# EAGLE design Qwiic Solid State Relay (EAGLE 9.6.0)
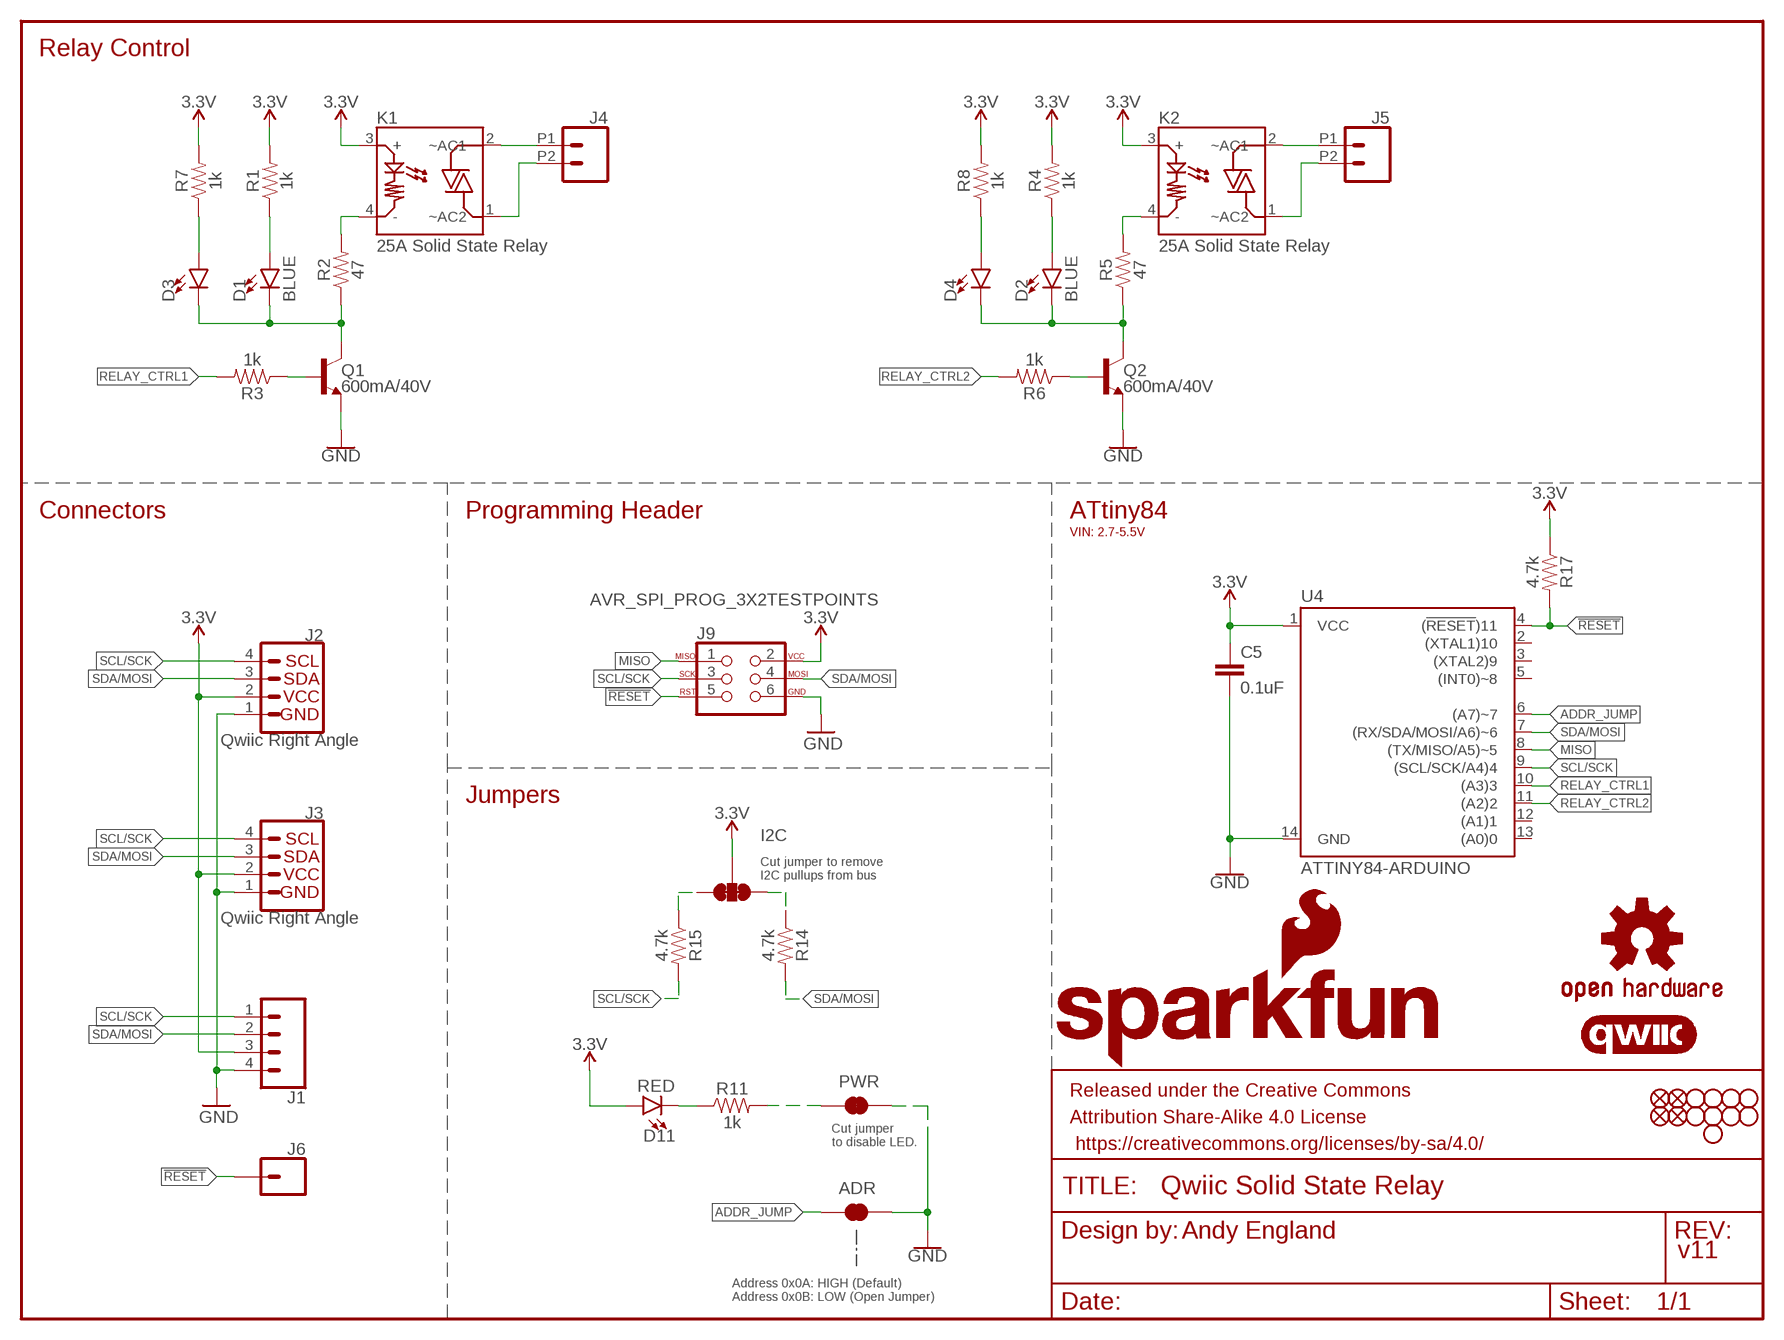
[diagram p0: schematic, sheet 1]

## Parts
ADR  JUMPER-SMT_2_NC_TRACE_SILK  [SMT-JUMPER_2_NC_TRACE_SILK]
C5  0.1uF  0.1UF-0603-25V-(+80/-20%)  [0603]
D1  BLUE  LED-BLUE0603  [LED-0603]
D2  BLUE  LED-BLUE0603  [LED-0603]
D3  LED5MM  [LED_5MM]
D4  LED5MM  [LED_5MM]
D11  RED  LED-RED0603  [LED-0603]
FD1  FIDUCIAL1X2  [FIDUCIAL-1X2]
FD2  FIDUCIAL1X2  [FIDUCIAL-1X2]
FD3  FIDUCIAL1X2  [FIDUCIAL-1X2]
FD4  FIDUCIAL1X2  [FIDUCIAL-1X2]
FRAME1  FRAME-LETTER  [CREATIVE_COMMONS]
I2C  JUMPER-SMT_3_2-NC_TRACE_SILK  [SMT-JUMPER_3_2-NC_TRACE_SILK]
J1  CONN_041X04_NO_SILK  [1X04_NO_SILK]
J2  Qwiic Right Angle  I2C_STANDARDQWIIC  [JST04_1MM_RA]
J3  Qwiic Right Angle  I2C_STANDARDQWIIC  [JST04_1MM_RA]
J4  CONN_02SCREWTERMINAL-6.35MM-2  [1X02_6.35_SCREWTERM]
J5  CONN_02SCREWTERMINAL-6.35MM-2  [1X02_6.35_SCREWTERM]
J6  CONN_01PTH_NO_SILK_YES_STOP  [1X01_NO_SILK]
J9  AVR_SPI_PROG_3X2TESTPOINTS  [2X3_TEST_POINTS]
JP1  STAND-OFF  [STAND-OFF]
JP2  STAND-OFF  [STAND-OFF]
JP3  STAND-OFF  [STAND-OFF]
JP4  STAND-OFF  [STAND-OFF]
JP5  STAND-OFF  [STAND-OFF]
JP6  STAND-OFF  [STAND-OFF]
JP7  STAND-OFF  [STAND-OFF]
JP8  STAND-OFF  [STAND-OFF]
JP10  STAND-OFF  [STAND-OFF]
K1  25A Solid State Relay  SIP_SOLIDSTATERELAY  [PTH_SOLIDSTATERELAY]
K2  25A Solid State Relay  SIP_SOLIDSTATERELAY  [PTH_SOLIDSTATERELAY]
LOGO1  SFE_LOGO_NAME_FLAME.2_INCH  [SFE_LOGO_NAME_FLAME_.2]
LOGO2  OSHW-LOGOS  [OSHW-LOGO-S]
LOGO3  SFE_LOGO_NAME_FLAME.3_INCH  [SFE_LOGO_NAME_FLAME_.3]
LOGO4  QWIIC_LOGO_5MM  [QWIIC_5MM]
PWR  JUMPER-SMT_2_NC_TRACE_SILK  [SMT-JUMPER_2_NC_TRACE_SILK]
Q1  600mA/40V  TRANS_NPN-MMBT2222AL  [SOT23-3]
Q2  600mA/40V  TRANS_NPN-MMBT2222AL  [SOT23-3]
R1  1k  1KOHM-0603-1/10W-1%  [0603]
R2  47  47OHM-0603-1/10W-1%  [0603]
R3  1k  1KOHM-0603-1/10W-1%  [0603]
R4  1k  1KOHM-0603-1/10W-1%  [0603]
R5  47  47OHM-0603-1/10W-1%  [0603]
R6  1k  1KOHM-0603-1/10W-1%  [0603]
R7  1k  1KOHM-0603-1/10W-1%  [0603]
R8  1k  1KOHM-0603-1/10W-1%  [0603]
R11  1k  1KOHM-0603-1/10W-1%  [0603]
R14  4.7k  4.7KOHM-0603-1/10W-1%  [0603]
R15  4.7k  4.7KOHM-0603-1/10W-1%  [0603]
R17  4.7k  4.7KOHM-0603-1/10W-1%  [0603]
U4  ATTINY84-ARDUINO  [SO14]

## Nets
3.3V: C5.1 D11.A I2C.2 J1.3 J2.2 J3.2 J9.2 K1.3(+) K2.3(+) R1.2 R4.2 R7.2 R8.2 R17.1 U4.1(VCC)
!RESET: J6.1 J9.5 R17.2 U4.4((!RESET!)11)
ADDR_JUMP: ADR.1 U4.6((A7)~7)
GND: ADR.2 C5.2 J1.4 J2.1 J3.1 J9.6 PWR.1 Q1.2(E) Q2.2(E) U4.14(GND)
MISO: J9.1 U4.8((TX/MISO/A5)~5)
N$3: K2.4(-) R5.2
N$4: D2.A R4.1
N$5: J4.P1 K1.2(~AC1)
N$6: J4.P2 K1.1(~AC2)
N$7: D1.A R1.1
N$8: J5.P1 K2.2(~AC1)
N$9: J5.P2 K2.1(~AC2)
N$10: K1.4(-) R2.2
N$11: D1.C D3.K(C) Q1.3(C) R2.1
N$12: D3.A R7.1
N$13: D11.C R11.1
N$14: PWR.2 R11.2
N$15: I2C.3 R15.1
N$16: I2C.1 R14.1
N$17: D2.C D4.K(C) Q2.3(C) R5.1
N$18: D4.A R8.1
OPTO_1: Q1.1(B) R3.1
OPTO_2: Q2.1(B) R6.1
RELAY_CTRL1: R3.2 U4.10((A3)3)
RELAY_CTRL2: R6.2 U4.11((A2)2)
SCL/SCK: J1.1 J2.4 J3.4 J9.3 R15.2 U4.9((SCL/SCK/A4)4)
SDA/MOSI: J1.2 J2.3 J3.3 J9.4 R14.2 U4.7((RX/SDA/MOSI/A6)~6)
Unconnected: U4.2((XTAL1)10) U4.3((XTAL2)9) U4.5((INT0)~8) U4.12((A1)1) U4.13((A0)0)

## Notes on the sheet
- Relay Control
- Connectors | Programming Header | ATtiny84
- VIN: 2.7-5.5V
- Jumpers
- Cut jumper to remove 
  I2C pullups from bus
- Cut jumper 
  to disable LED.
- Andy England
- v11
- Address 0x0A: HIGH (Default)
  Address 0x0B: LOW (Open Jumper)

## Library data of the parts
ADR PWR = SparkFun-Jumpers:JUMPER-SMT_2_NC_TRACE: Normally closed trace jumper This jumper has a trace between two pads so it's normally closed (NC). Use a razor knife to open the connection. For best results follow the IPC guidelines for cutting traces: Cutout at least 0.063 mm (0.005 in). Remove all loose material to clean up the cut area. Seal the cut with an approved epoxy. Reapply solder to reclose the connection.
C5 = SparkFun-Capacitors:0.1UF: 0.1µF ceramic capacitors A capacitor is a passive two-terminal electrical component used to store electrical energy temporarily in an electric field.; PROD_ID: CAP-00810
D1 D2 = SparkFun-LED:LED-BLUE: Blue SMD LED Used in manufacturing of various products at SparkFun Packages: 0603 - SMD 0603 package [Product Link] <http://www.digikey.com/product-detail/en/SMLE12BC7TT86/511-1589-2-ND/1641808> 1206 - SMD1206 package [Product Link] <http://www.digikey.com/product-detail/en/lite-on-inc/LTST-C150TBKT/160-1643-1-ND/573584> SparkFun Products: ESP8266 Thing-Dev Board <https://www.sparkfun.com/products/13711> RedBoard <https://www.sparkfun.com/products/12757>; PROD_ID: DIO-08575
D3 D4 = SparkFun-LED:LED: LED (Generic) Standard schematic elements and footprints for 5mm, 3mm, 1206, and 0603 sized LEDs. Generic LEDs with no color specified.
D11 = SparkFun-LED:LED-RED: Red SMD LED Used in manufacturing of most products at SparkFun Packages: 0603 - SMD 0603 package [Product Link] <http://docs.avagotech.com/docs/AV02-0551EN> 0603 SMART - SMD 0603 SMART package ( more efficient and expensive)[Product Link] <http://www.osram-os.com/Graphics/XPic2/00077099_0.pdf> 1206 - SMD1206 package [Product Link] <https://www.sparkfun.com/datasheets/DevTools/LilyPad/Q150OVS4.pdff> SparkFun Products: Pro Mini 328 -5V <https://www.sparkfun.com/products/821> RedBoard <https://www.sparkfun.com/products/12757> IOIO-OTG <https://www.sparkfun.com/products/13613>; PROD_ID: DIO-00819
FD1-FD4 = SparkFun-Aesthetics:FIDUCIAL: Fiducial Alignment Points Point-of-reference for pick-and-place machines and other optical instruments.
FRAME1 = SparkFun-Aesthetics:FRAME-LETTER: Schematic Frame - Letter Standard 8.5x11 US Letter frame
I2C = SparkFun-Jumpers:JUMPER-SMT_3_2-NC_TRACE: Normally closed trace jumper (2 of 2 connections) This jumper has a trace between all three pads so they are normally closed (NC). Use a razor knife to open the connection(s). For best results follow the IPC guidelines for cutting traces: Cutout at least 0.063 mm (0.005 in). Remove all loose material to clean up the cut area. Seal the cut with an approved epoxy. Reapply solder to reclose the connection(s).
J1 = SparkFun-Connectors:CONN_04: Multi connection point. Often used as Generic Header-pin footprint for 0.1 inch spaced/style header connections On any of the 0.1 inch spaced packages, you can populate with these: Break Away Headers - Straight <https://www.sparkfun.com/products/116> (PRT-00116) Break Away Male Headers - Right Angle <https://www.sparkfun.com/products/553> (PRT-00553) Female Headers <https://www.sparkfun.com/products/115> (PRT-00115) Break Away Headers - Machine Pin <https://www.sparkfun.com/products/117> (PRT-00117) Break Away Female Headers - Swiss Machine Pin <https://www.sparkfun.com/products/743> (PRT-00743) For SCREWTERMINALS and SPRING TERMINALS visit here: Screw Terimnals on SparkFun.com <https://www.sparkfun.com/search/results?term=Screw+Terminals> (5mm/3.5mm/2.54mm spacing) This device is also useful as a general connection point to wire up your design to another part of your project. Our various solder wires solder well into these plated through hole pads. Hook-Up Wire - Assortment (Stranded, 22 AWG) <https://www.sparkfun.com/products/11375> (PRT-11375) Hook-Up Wire - Assortment (Solid Core, 22 AWG) <https://www.sparkfun.com/products/11367> (PRT-11367) View the entire wire category on our website here <https://www.sparkfun.com/categories/141> Special notes: Molex polarized connector foot print use with SKU : PRT-08231 with associated crimp pins and housings. 1MM SMD Version SKU: PRT-10208; PROD_ID: CONN-09696
J2 J3 = SparkFun-Connectors:I2C_STANDARD: SparkFun I2C Standard Pinout Header SparkFun has standardized on a pinout for all I2C based sensor breakouts. This pinout allows I2C boards to be plugged directly into the headers on Arduino Uno compatible boards, and to be daisy chained easily. Example SparkFun Products: SparkFun Atmospheric Sensor Breakout - BME280 <https://www.sparkfun.com/products/13676> SparkFun Altitude/Pressure Sensor Breakout - MPL3115A2 <https://www.sparkfun.com/products/11084> SparkFun TOF Range Finder Sensor - VL6180 <https://www.sparkfun.com/products/12785>; PROD_ID: CONN-13694
J4 J5 = SparkFun-Connectors:CONN_02: Multi connection point. Often used as Generic Header-pin footprint for 0.1 inch spaced/style header connections On any of the 0.1 inch spaced packages, you can populate with these: Break Away Headers - Straight <https://www.sparkfun.com/products/116> (PRT-00116) Break Away Male Headers - Right Angle <https://www.sparkfun.com/products/553> (PRT-00553) Female Headers <https://www.sparkfun.com/products/115> (PRT-00115) Break Away Headers - Machine Pin <https://www.sparkfun.com/products/117> (PRT-00117) Break Away Female Headers - Swiss Machine Pin <https://www.sparkfun.com/products/743> (PRT-00743) For SCREWTERMINALS and SPRING TERMINALS visit here: Screw Terimnals on SparkFun.com <https://www.sparkfun.com/search/results?term=Screw+Terminals> (5mm/3.5mm/2.54mm spacing) This device is also useful as a general connection point to wire up your design to another part of your project. Our various solder wires solder well into these plated through hole pads. Hook-Up Wire - Assortment (Stranded, 22 AWG) <https://www.sparkfun.com/products/11375> (PRT-11375) Hook-Up Wire - Assortment (Solid Core, 22 AWG) <https://www.sparkfun.com/products/11367> (PRT-11367) View the entire wire category on our website here <https://www.sparkfun.com/categories/141> Special notes: Molex polarized connector foot print use with: PRT-08233 with associated crimp pins and housings. 2.54_SCREWTERM for use with PRT-10571. 3.5mm Screw Terminal footprints for PRT-08084 5mm Screw Terminal footprints for use with PRT-08432; PROD_ID: CONN-15154
J6 = SparkFun-Connectors:CONN_01: Single connection point. Often used as Generic Header-pin footprint for 0.1 inch spaced/style header connections On any of the 0.1 inch spaced packages, you can populate with these: Break Away Headers - Straight <https://www.sparkfun.com/products/116> (PRT-00116) Break Away Male Headers - Right Angle <https://www.sparkfun.com/products/553> (PRT-00553) Female Headers <https://www.sparkfun.com/products/115> (PRT-00115) Break Away Headers - Machine Pin <https://www.sparkfun.com/products/117> (PRT-00117) Break Away Female Headers - Swiss Machine Pin <https://www.sparkfun.com/products/743> (PRT-00743) This device is also useful as a general connection point to wire up your design to another part of your project. Our various solder wires solder well into these plated through hole pads. Hook-Up Wire - Assortment (Stranded, 22 AWG) <https://www.sparkfun.com/products/11375> (PRT-11375) Hook-Up Wire - Assortment (Solid Core, 22 AWG) <https://www.sparkfun.com/products/11367> (PRT-11367) View the entire wire category on our website here <https://www.sparkfun.com/categories/141> Special notes: SMTSO-256-ET is a "flush mount" nut for a 4-40 screw. We mostly use this on specialty testbeds; it is a nice way to connect hardware to your PCB at an adjustable hieght. Also note, the SNAP packages are for using a snappable style connector. We sell a baggie of snaps and they are also used on two LilyPad designs: Snap Assortment - 30 pack (male and female) <https://www.sparkfun.com/products/11347> (DEV-11347) LilyPad Arduino SimpleSnap <https://www.sparkfun.com/products/10941> (DEV-10941) LilyPad SimpleSnap Protoboard <https://www.sparkfun.com/products/10940> (DEV-10940)
J9 = SparkFun-Connectors:AVR_SPI_PROG_3X2: AVR ISP 6 Pin This is the reduced ISP connector for AVR programming. Common on Arduino. This footprint will take up less PCB space and can be used with a 10-pin to 6-pin adapter such as SKU: BOB-08508 **Special note about "TEST_POINT" package. The stop mask is on the top side, so if you want your programming test points to be on the bottom of your board, make sure to place this package on the bottom side of the board. This also ensure that the orientation to program from the bottom side will be correct. SparkFun Products: SparkFun ISP Pogo Adapter <https://www.sparkfun.com/products/11591> - NS Tiny AVR Programmer <https://www.sparkfun.com/products/11801> -PTH
JP1-JP8 JP10 = SparkFun-Hardware:STAND-OFF: Stand Off Drill holes for mechanically mounting via screws, standoffs, etc. Note: Use the keepout ring to avoid running the screw head into surrounding components. Variant Overviews STAND-OFF - Mechanical footprint for a #4 phillips button head screw. STAND-OFF-TIGHT - Mechanical footprint for a #4 phillips button head screw, Example SparkFun Products Screw - Phillips Head (1/4", 4-40, 10 pack) <https://www.sparkfun.com/products/10453> (PRT-10453) Screw - Phillips Head (1/2", 4-40, 10 pack) <https://www.sparkfun.com/products/10452> (PRT-10452) Screw - Phillips Head (3/4", 4-40, 10 pack) <https://www.sparkfun.com/products/10451> (PRT-10451) Screw - Phillips Head (1", 4-40, 10 pack) <https://www.sparkfun.com/products/10450> (PRT-10450)
K1 K2 = SparkFun-DiscreteSemi:SIP_SOLIDSTATERELAY: Tyco Electronics SSRF-240D25 - 25A Solid State Relay This through hole Solid State Relay is capable of handling up to 25A and uses Zero-Crossing to minimize interference when switching an AC load; PROD_ID: COM-15155
LOGO1 LOGO3 = SparkFun-Aesthetics:SFE_LOGO_NAME_FLAME: SparkFun Font Logo w/ Flame This is the SparkFun full logo. The logo on the schematic will always be the same size; the package variant is the height of the flame part of the logo. Default layer for the logo on the board is tSilk.
LOGO2 = SparkFun-Aesthetics:OSHW-LOGO: Open-Source Hardware (OSHW) Logo This logo indicates the piece of hardware it is found on incorporates a OSHW license and/or adheres to the definition of open source hardware found here: http://freedomdefined.org/OSHW
LOGO4 = SparkFun-Aesthetics:QWIIC_LOGO: Qwiic Logos for placement on schematic and PCB. The 5.5mm silk logo is best for placing next to Qwiic connector.
Q1 Q2 = SparkFun-DiscreteSemi:TRANS_NPN: NPN transistor Current controlled devices typically used to amplify current or used as a switch. BC547 - COM-08928 <http://www.sparkfun.com/products/8928> (TO-92 45V 100mA) (1.Collector 2.Base 3.Emitter) 2N3904 - COM-00521 <http://www.sparkfun.com/products/521> (TO-92 40V 200mA) (1.Emitter 2.Base 3.Collector) P2N2222A - COM-12852 <http://www.sparkfun.com/products/12852> (TO-92 40V 600mA) (1.Collector 2.Base 3.Emitter); PROD_ID: TRANS-08049
R1 R3 R4 R6-R8 R11 = SparkFun-Resistors:1KOHM: 1kΩ resistor A resistor is a passive two-terminal electrical component that implements electrical resistance as a circuit element. Resistors act to reduce current flow, and, at the same time, act to lower voltage levels within circuits. - Wikipedia; PROD_ID: RES-07856
R2 R5 = SparkFun-Resistors:47OHM: 47Ω resistor A resistor is a passive two-terminal electrical component that implements electrical resistance as a circuit element. Resistors act to reduce current flow, and, at the same time, act to lower voltage levels within circuits. - Wikipedia; PROD_ID: RES-14282
R14 R15 R17 = SparkFun-Resistors:4.7KOHM: 4.7kΩ resistor A resistor is a passive two-terminal electrical component that implements electrical resistance as a circuit element. Resistors act to reduce current flow, and, at the same time, act to lower voltage levels within circuits. - Wikipedia; PROD_ID: RES-07857
U4 = SparkFun-IC-Microcontroller:ATTINY84-ARDUINO; PROD_ID: IC-14155

## Board
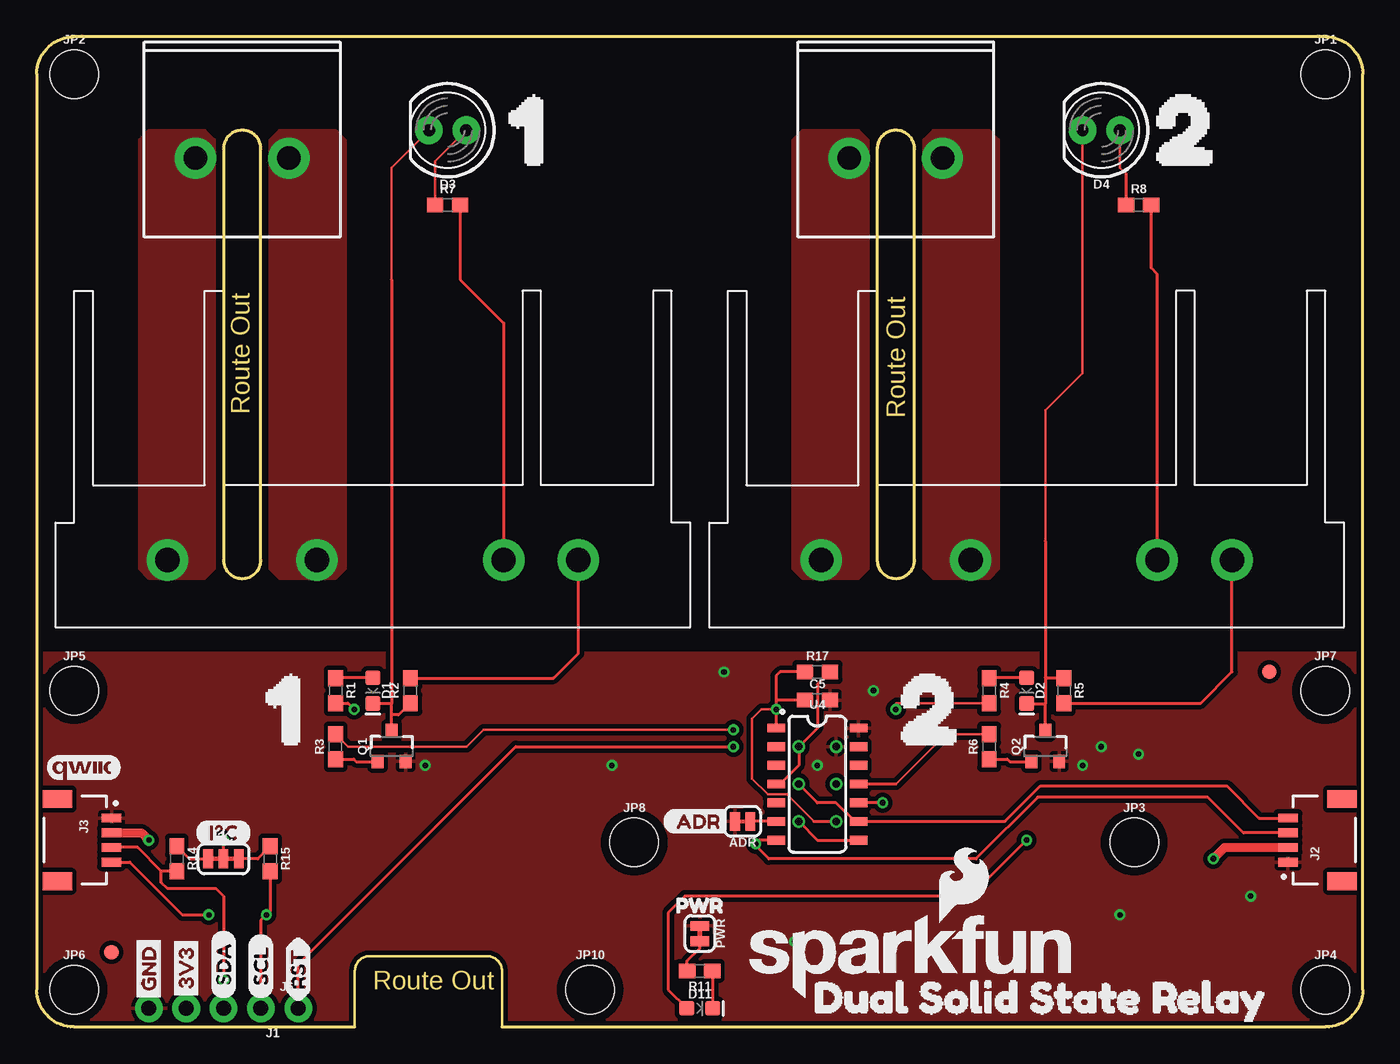
[diagram p1: board, top side]
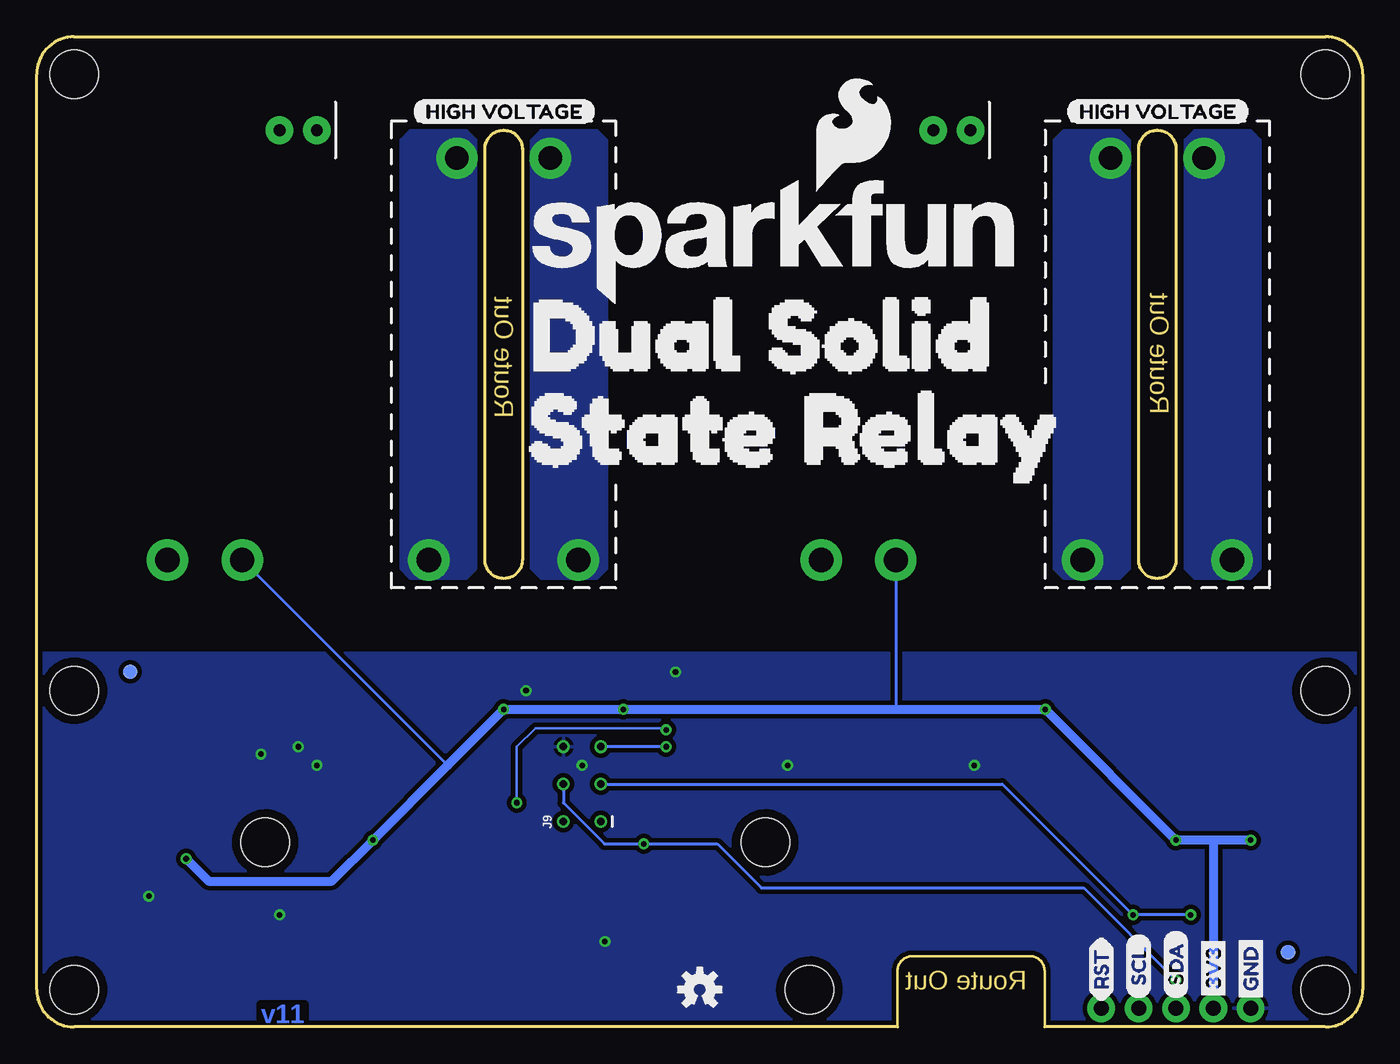
[diagram p2: board, bottom side, seen from below]

Size 90.17 x 67.31 mm. Coordinates in mm from the lower left corner, seen from the top.
Outline: 2.54,0 21.63,0 21.63,3.81 arc-90 22.63,4.81 30.63,4.81 arc-90 31.63,3.81 31.63,0 87.63,0 arc90 90.17,2.54 90.17,64.77 arc90 87.63,67.31 2.54,67.31 arc90 0,64.77 0,2.54 arc90 2.54,0
Outline: 13.97,60.96 arc90 12.7,59.69 12.7,31.75 arc90 13.97,30.48 arc90 15.24,31.75 15.24,59.69 arc90 13.97,60.96
Outline: 58.42,30.48 arc90 59.69,31.75 59.69,59.69 arc90 58.42,60.96 arc90 57.15,59.69 57.15,31.75 arc90 58.42,30.48
Copper layers (1*16): Top 0.035mm / dielectric 1.5mm / Bottom 0.035mm
Design rules "SparkFun-2-layer-TIGHT": minimum track width 7mil, minimum drill 15mil, track to track 7mil, track to pad 7mil, pad to pad 7mil, via to via 7mil, smd to smd 7mil, copper to edge 7mil, drill to drill 7mil, minimum pad ring 7mil, minimum via ring 7mil, stop-mask expansion 4mil, vias tented up to drill 25mil, thermal gap 10mil

### Footprints (pad centres in the part's own frame; a part is rotated, then mirrored left to right if it is on the bottom)
SMT-JUMPER_2_NC_TRACE_SILK = smd 0.66 x 1.27: 1 -0.521,0; 2 0.521,0
0603 = smd 1.1 x 1: 1 -0.85,0; 2 0.85,0
LED-0603 = smd 1 x 1: A -0.877,0; C 0.877,0
LED_5MM = drill 0.813 pad 1.88: A -1.27,0; K 1.27,0
FIDUCIAL-1X2 = smd 1 x 1: 1 0,0
SMT-JUMPER_3_2-NC_TRACE_SILK = smd 0.66 x 1.27: 1 -1.041,0; 2 0,0; 3 1.041,0
1X04_NO_SILK = drill 1.016 pad 1.88: 1 0,0; 2 2.54,0; 3 5.08,0; 4 7.62,0
JST04_1MM_RA = smd 0.6 x 1.35: 1 -1.5,0; 2 -0.5,0; 3 0.5,0; 4 1.5,0 | smd 1.2 x 2: NC1 2.8,-3.675; NC2 -2.8,-3.675
1X02_6.35_SCREWTERM = drill 1.6 pad 2.8: P1 -3.175,0; P2 3.175,0
1X01_NO_SILK = drill 1.016 pad 1.88: 1 0,0
2X3_TEST_POINTS = drill 0.508: 1 -2.54,-1.27; 2 -2.54,1.27; 3 0,-1.27; 4 0,1.27; 5 2.54,-1.27; 6 2.54,1.27
STAND-OFF = hole 3.302: 0,0
PTH_SOLIDSTATERELAY = drill 1.651 pad 2.819: 1 0,0; 2 10.16,0; 3 22.86,0; 4 27.94,0
SOT23-3 = smd 0.8 x 0.9: 1 -0.95,-1; 2 0.95,-1; 3 0,1.1
SO14 = smd 0.6 x 1.2: 1 -3.81,-2.8; 2 -2.54,-2.8; 3 -1.27,-2.8; 4 0,-2.8; 5 1.27,-2.8; 6 2.54,-2.8; 7 3.81,-2.8; 8 3.81,2.8; 9 2.54,2.8; 10 1.27,2.8; 11 0,2.8; 12 -1.27,2.8; 13 -2.54,2.8; 14 -3.81,2.8

### Placement (x,y rotation side)
ADR  48.01,13.97 180 top
C5  53.09,22.23 0 top
D1  22.86,22.86 270 top
D2  67.31,22.86 270 top
D3  27.94,60.96 180 top
D4  72.39,60.96 180 top
D11  45.09,1.27 0 top
FD1  83.82,24.13 0 top
FD2  83.82,24.13 0 bottom
FD3  5.08,5.08 0 bottom
FD4  5.08,5.08 0 top
FRAME1  22.86,-8.89 0 top  (outside the outline)
I2C  12.7,11.43 0 top
J1  15.24,1.27 180 top
J2  85.09,12.7 90 top
J3  5.08,12.7 270 top
J4  13.97,59.05 180 top
J5  58.42,59.05 180 top
J6  17.78,1.27 0 top
J9  53.09,16.51 90 bottom
JP1  87.63,64.77 0 top
JP2  2.54,64.77 0 top
JP3  74.63,12.54 0 top
JP4  87.63,2.54 0 top
JP5  2.54,22.86 0 top
JP6  2.54,2.54 0 top
JP7  87.63,22.86 0 top
JP8  40.63,12.54 0 top
JP10  37.63,2.54 0 top
K1  8.89,31.75 0 top
K2  53.34,31.75 0 top
LOGO1  59.48,4.81 0 top
LOGO2  45.09,2.54 0 bottom
LOGO3  40.13,53.34 0 bottom
LOGO4  3.17,17.65 0 top
PWR  45.09,6.35 270 top
Q1  24.13,19.05 0 top
Q2  68.58,19.05 0 top
R1  20.32,22.86 270 top
R2  25.4,22.86 90 top
R3  20.32,19.05 90 top
R4  64.77,22.86 270 top
R5  69.85,22.86 270 top
R6  64.77,19.05 90 top
R7  27.94,55.88 0 top
R8  74.93,55.88 0 top
R11  45.09,3.81 180 top
R14  9.53,11.43 270 top
R15  15.88,11.43 270 top
R17  53.09,24.13 0 top
U4  53.09,16.51 270 top
U$1  [DUAL_SOLID_STATE_RELAY0]  51,2 0 top
U$2  [DUAL_SOLID0]  60.71,46.99 0 bottom
U$3  [STATE_RELAY1]  60.83,40.64 0 bottom
U$5  [11]  11.43,21.59 0 top
U$6  [22]  54.61,21.59 0 top
U$7  [HIGH_VOLTAGE0]  20.19,62.23 0 bottom
U$8  [HIGH_VOLTAGE0]  64.64,62.23 0 bottom
U$9  [11]  27.94,60.96 0 top
U$10  [22]  72.01,60.96 0 top
U$11  [RST_I]  17.78,1.65 90 top
U$12  [RST_I]  17.78,1.65 90 bottom
U$13  [GND_P]  7.62,1.52 90 top
U$14  [GND_P]  7.62,1.52 90 bottom
U$15  [I2C]  10.79,13.21 0 top
U$16  [3V3_P]  10.16,1.65 90 top
U$17  [3V3_P]  10.16,1.65 90 bottom
U$18  [SCL_IO]  15.24,1.91 90 top
U$19  [SCL_IO]  15.24,1.91 90 bottom
U$20  [SDA_IO]  12.7,1.91 90 top
U$21  [SDA_IO]  12.7,1.91 90 bottom
U$23  [ADR3]  42.54,13.97 0 top
U$24  [PWR_TO]  42.55,8.26 0 top

### Tracks (layer width: path | path; a pad name or v marks a point on that pad's centre or on a via)
3.3V  (via drill 0.38)
  Top 0.178: R4.2 58.46,22.01 58.42,21.97 v58.42,21.59 | v50.28,21.59 49.27,21.59 48.64,20.95 48.64,16.88 49.71,15.81 51.01,15.81 52.85,13.97
  Top 0.203: R17.1 50.55,24.13 50.28,23.87 50.28,22.23 | 50.28,22.23 v50.28,21.59 U4.1 | C5.1 50.28,22.23 | 52.85,13.97 J9.2 | v67.31,12.7 63.5,8.89 44.08,8.89 42.94,7.75 42.94,2.54 D11.A | I2C.2 v12.7,12.7 | R7.2 28.79,50.8 31.75,47.84 K1.3 | R1.2 21.17,22.01 v21.59,21.59 | R8.2 75.78,51.6 76.2,51.18 K2.3
  Top 0.61: J3.2 7.12,13.2 v7.62,12.7 | v80.01,11.43 80.78,12.2 J2.2
  Bottom 0.203: K1.3 31.75,21.59 | K2.3 62.23,17.78
  Bottom 0.61: v7.62,12.7 10.16,12.7 | 10.16,12.7 v12.7,12.7 v21.59,21.59 31.75,21.59 v50.28,21.59 v58.42,21.59 62.23,17.78 v67.31,12.7 70.1,9.91 78.49,9.91 v80.01,11.43 | 10.16,12.7 J1.3
!RESET  (via drill 0.38)
  Top 0.203: R17.2 53.09,23.28 53.09,20.32 J9.5 51.81,17.78 50.55,16.51 U4.4 | J6.1 17.78,4.27 32.56,19.05 v47.37,19.05
  Bottom 0.203: v47.37,19.05 J9.5
ADDR_JUMP
  Top 0.203: U4.6 ADR.1
GND  (via drill 0.38)
  other vias: 46.73,24.13 56.9,22.86 53.09,17.78 74.93,18.54 71.12,17.78 51.53,5.81 73.66,7.62 72.39,19.05 82.55,8.89 26.41,17.78 39.12,17.78
  pour Top (isolate 0.305): 0,0 90.17,0 90.17,25.4 0,25.4
  pour Bottom (isolate 0.305): 90.17,0 0,0 0,25.4 90.17,25.4
MISO
  Top 0.203: J9.1 53.09,12.7 U4.8
N$3
  Top 0.203: R5.2 79.16,22.01 81.28,24.13 K2.4
N$4
  Top 0.203: D2.A 64.8,23.74 R4.1
N$5
  pour Bottom (no thermals): 20.32,60.96 16.51,60.96 15.88,60.33 15.88,31.11 16.51,30.48 20.32,30.48 20.95,31.11 20.95,60.33
  pour Top (no thermals): 16.51,60.96 20.32,60.96 20.95,60.33 20.95,31.11 20.32,30.48 16.51,30.48 15.88,31.11 15.88,60.33
N$6
  pour Bottom (no thermals): 11.43,60.96 7.62,60.96 6.99,60.33 6.99,31.11 7.62,30.48 11.43,30.48 12.06,31.11 12.06,60.33
  pour Top (no thermals): 7.62,60.96 11.43,60.96 12.06,60.33 12.06,31.11 11.43,30.48 7.62,30.48 6.99,31.11 6.99,60.33
N$7
  Top 0.203: D1.A 20.35,23.74 R1.1
N$8
  pour Top (no thermals): 60.96,60.96 64.77,60.96 65.41,60.33 65.41,31.11 64.77,30.48 60.96,30.48 60.33,31.11 60.33,60.33
  pour Bottom (no thermals): 64.77,60.96 60.96,60.96 60.33,60.33 60.33,31.11 60.96,30.48 64.77,30.48 65.41,31.11 65.41,60.33
N$9
  pour Bottom (no thermals): 55.88,60.96 52.07,60.96 51.44,60.33 51.44,31.11 52.07,30.48 55.88,30.48 56.52,31.11 56.52,60.33
  pour Top (no thermals): 52.07,60.96 55.88,60.96 56.52,60.33 56.52,31.11 55.88,30.48 52.07,30.48 51.44,31.11 51.44,60.33
N$10
  Top 0.203: R2.2 35.14,23.71 36.83,25.4 K1.4
N$11
  Top 0.178: D3.K 24.13,58.42 24.13,50.8
  Top 0.203: 25.37,21.98 R2.1 24.6,21.21 24.13,21.21 | 24.13,21.98 D1.C | Q1.3 24.13,21.21 | 24.13,21.21 24.13,21.98 | 24.13,50.8 24.13,21.98
N$12
  Top 0.178: R7.1 27.09,58.84 D3.A
N$13
  Top 0.203: R11.1 45.96,3.78 D11.C
N$14
  Top 0.203: R11.2 44.23,4.48 45.09,5.33 PWR.2
N$15
  Top 0.203: R15.1 15.03,11.43 I2C.3
N$16
  Top 0.203: R14.1 10.38,11.43 I2C.1
N$17
  Top 0.178: D4.K 71.12,44.45 68.58,41.91 68.58,33.02
  Top 0.203: D2.C 68.58,21.98 | Q2.3 68.58,21.98 | 68.58,33.02 68.58,23.75 | 68.58,23.75 68.58,21.98 | R5.1 68.62,23.71 68.58,23.75
N$18
  Top 0.178: 74.08,58 73.66,58.42 D4.A
  Top 0.203: R8.1 74.08,58
OPTO_1
  Top 0.203: R3.1 21.55,18.2 21.72,18.03 23.16,18.03 Q1.1
OPTO_2
  Top 0.203: R6.1 66,18.2 66.17,18.03 67.61,18.03 Q2.1
RELAY_CTRL1  (via drill 0.38)
  Top 0.178: v47.37,20.19 30.37,20.19 29.23,19.05 21.17,19.05 R3.2
  Top 0.203: v57.53,15.24 U4.10
  Bottom 0.178: v47.37,20.19 47.5,20.32 56.26,20.32 57.53,19.05 v57.53,15.24
RELAY_CTRL2
  Top 0.178: R6.2 61.81,19.9 58.42,16.51
  Top 0.203: 58.42,16.51 U4.11
SCL/SCK  (via drill 0.38)
  Top 0.203: J9.3 53.09,15.24 54.35,15.24 55.62,13.97 U4.9 65.85,13.97 68.26,16.38 80.93,16.38 83.11,14.2 J2.4 | J1.1 15.24,7.24 v15.62,7.62 15.88,7.87 R15.2 | J3.4 6.33,11.2 9.91,7.62 v11.7,7.62
  Bottom 0.203: J9.3 24.51,16.51 v15.62,7.62 v11.7,7.62
SDA/MOSI  (via drill 0.38)
  Top 0.203: U4.7 49.14,12.7 v48.89,12.45 48.89,12.32 49.78,11.43 63.88,11.43 68.07,15.62 79.63,15.62 82.05,13.2 J2.3 | v12.7,3.17 12.7,8.89 12.19,9.4 8.89,9.4 8.47,9.82 8.47,10.58 | R14.2 8.47,10.58 | J3.3 6.85,12.2 8.47,10.58
  Bottom 0.203: J1.2 v12.7,3.17 18.97,9.45 40.89,9.45 43.89,12.45 v48.89,12.45 51.56,12.45 54.35,15.24 J9.4

### Text on the board
Bottom: v11
Dimension: Route Out | Route Out | Route Out
tDocu: Andy England